# EAGLE schematic Prairie_Dogs_V1.3 (EAGLE 9.6.2)
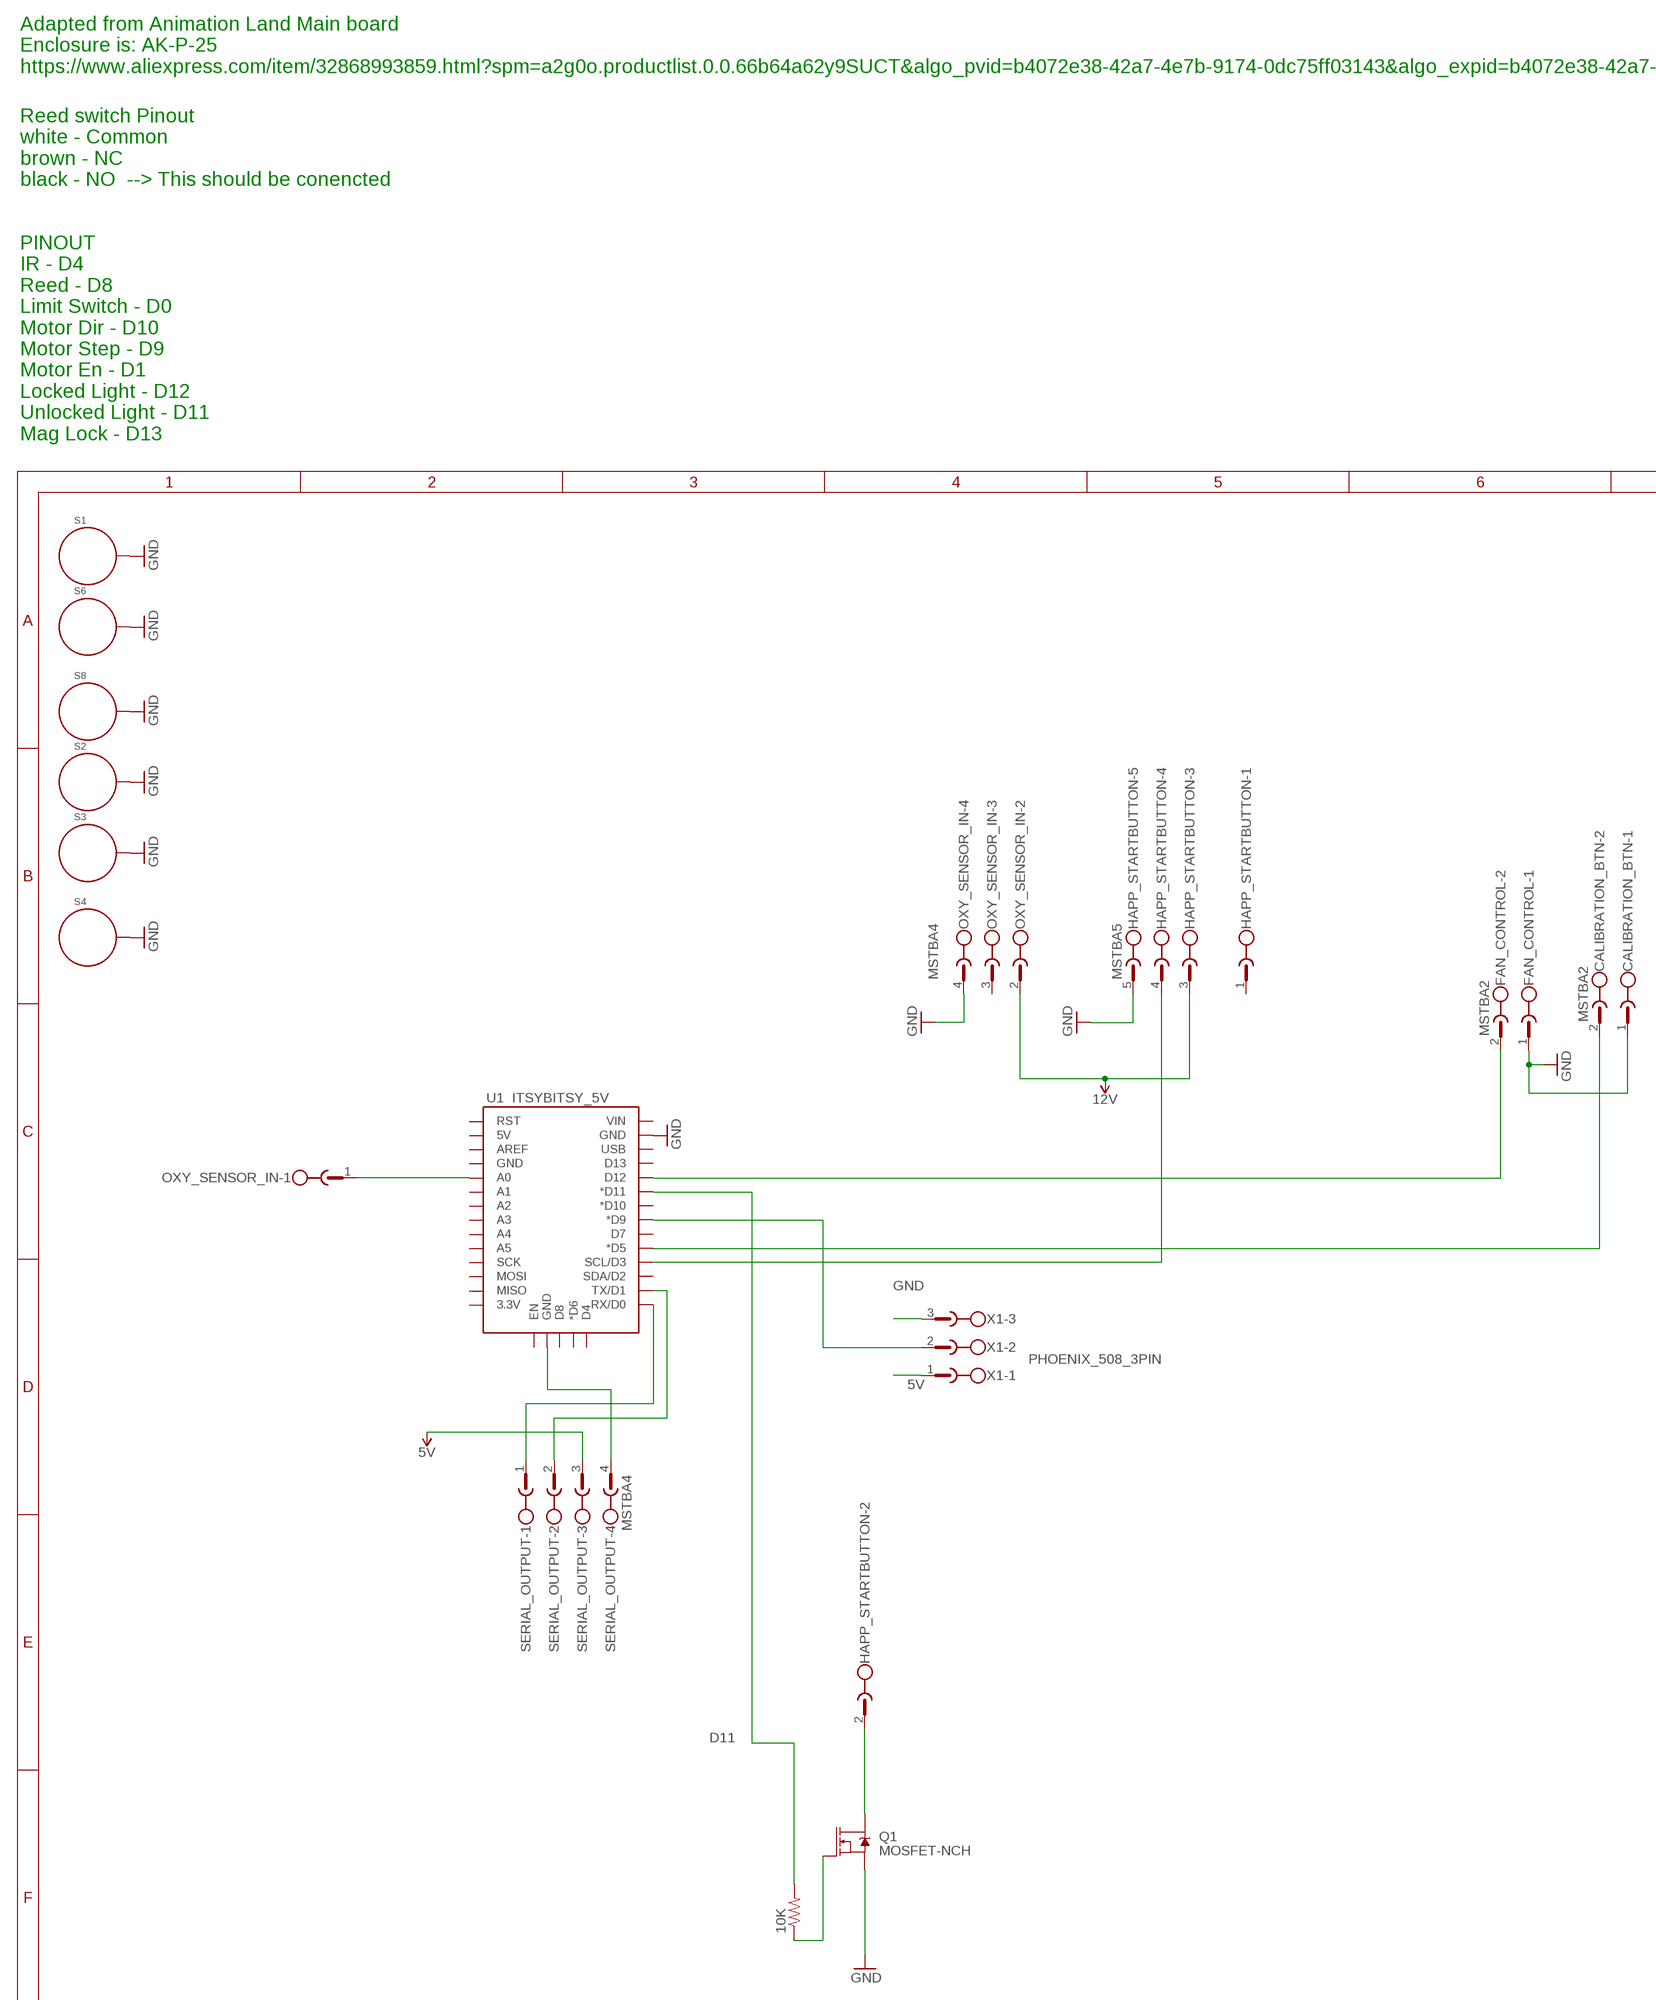
[diagram p0: schematic, sheet 1, part 1 of 2]
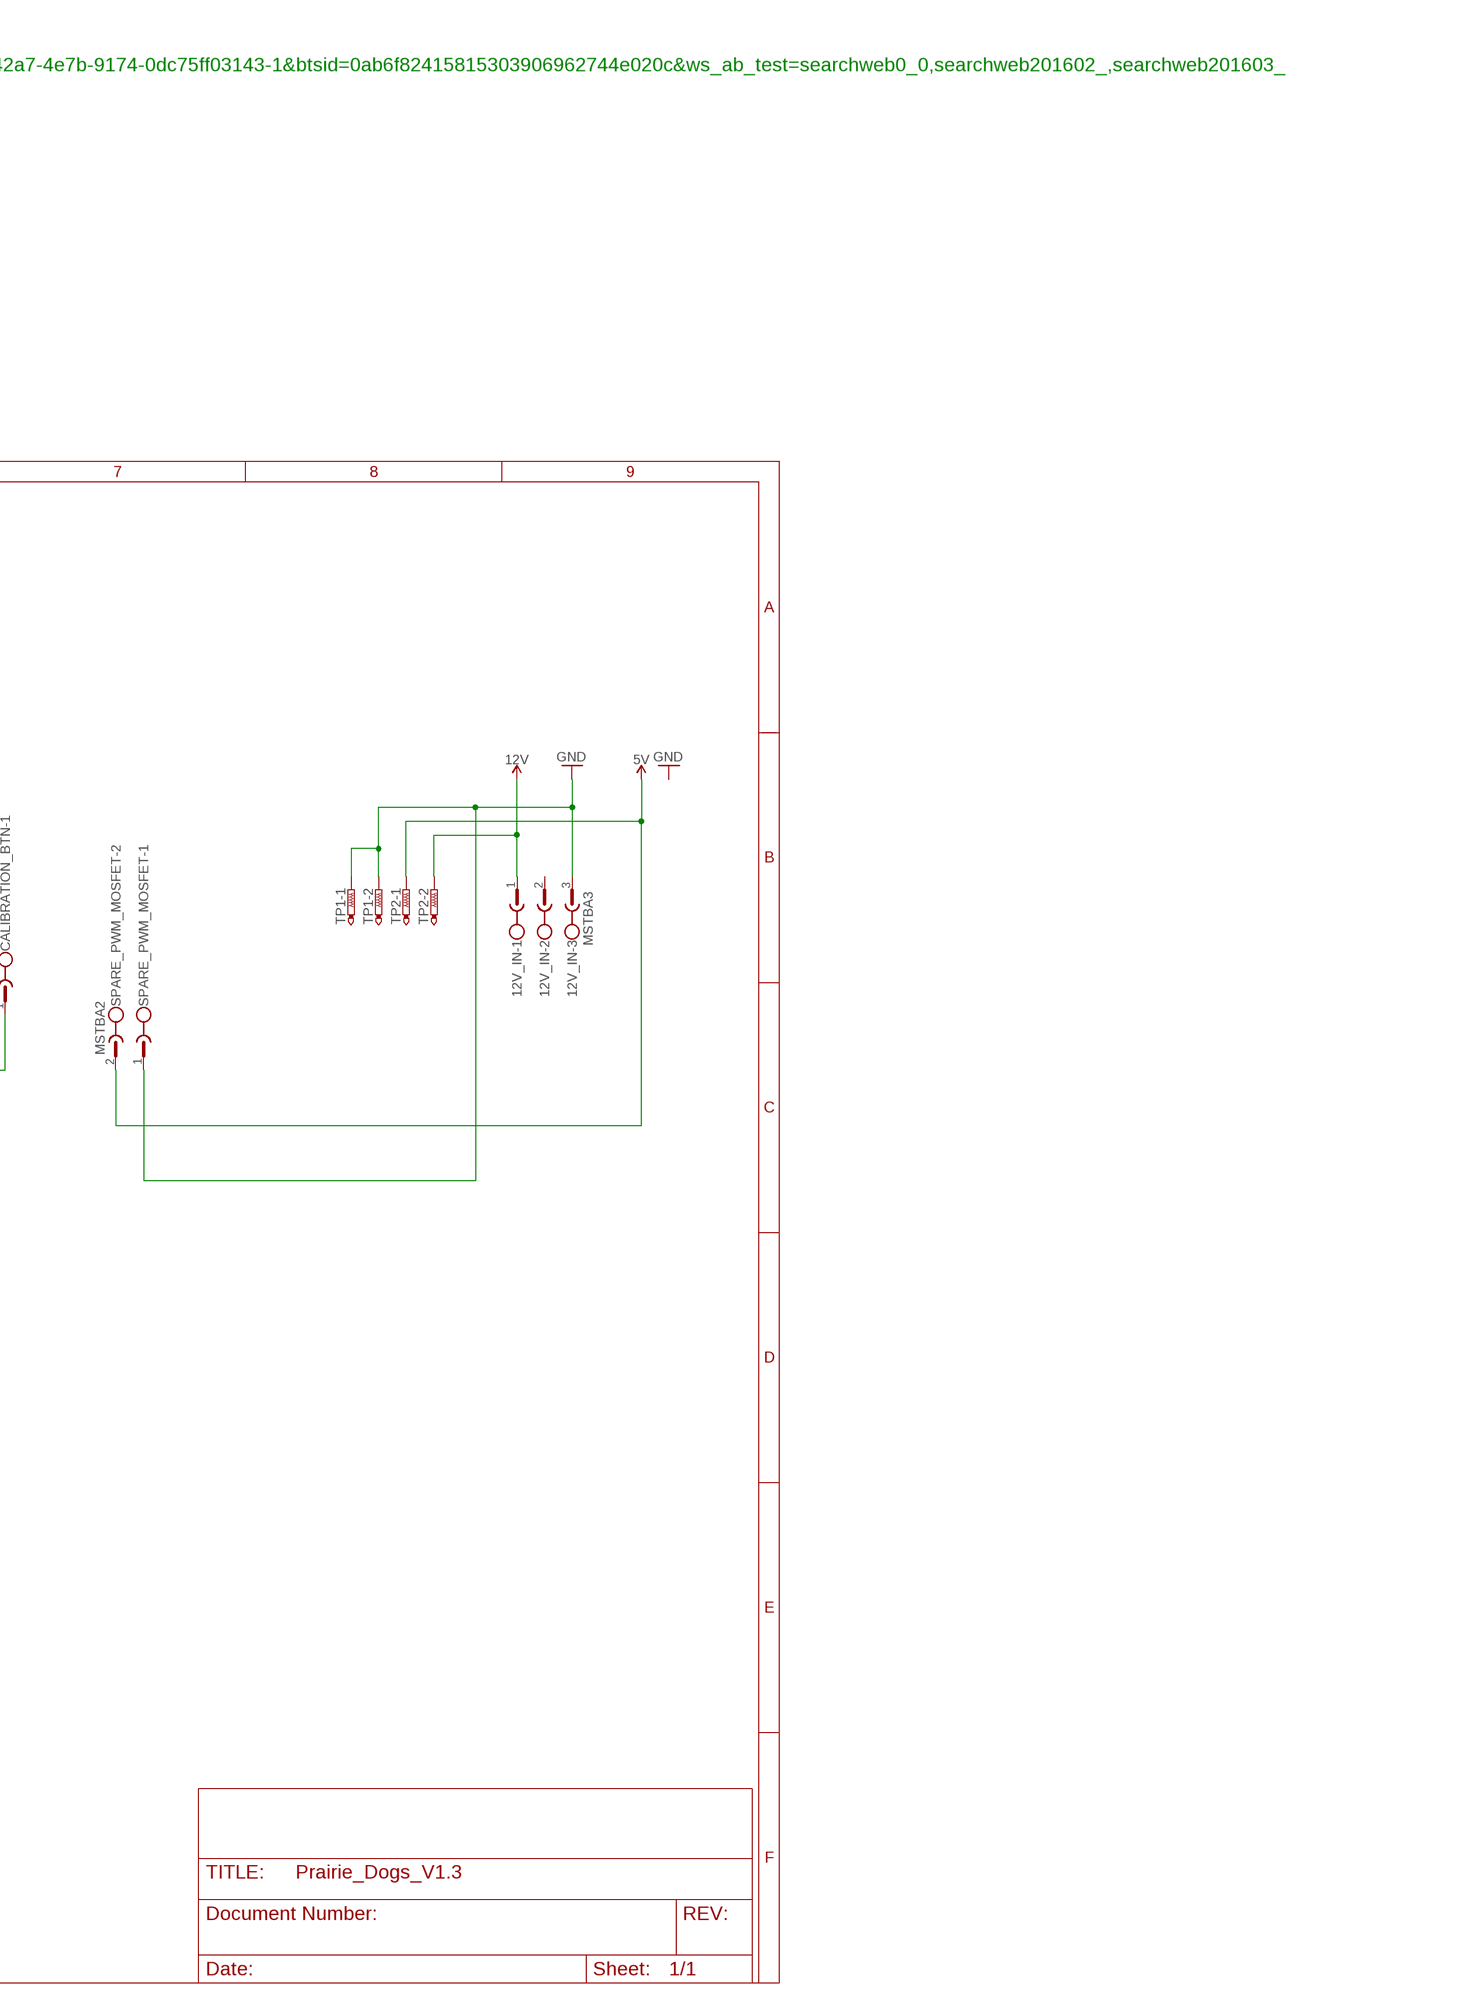
[diagram p1: schematic, sheet 1, part 2 of 2]

## Parts
10K  R-US_M0805  [M0805]
12V_IN  MSTBA3  [MSTBA3]
CALIBRATION_BTN  MSTBA2  [MSTBA2]
FAN_CONTROL  MSTBA2  [MSTBA2]
HAPP_STARTBUTTON  MSTBA5  [MSTBA5]
OXY_SENSOR_IN  MSTBA4  [MSTBA4]
Q1  MOSFET-NCH  [SO-8_POWER_PAK]
S1  STANDOFF_ELECTRICAL5-32  [STANDOFF_ELECTRICAL_5_32]
S2  STANDOFF_ELECTRICAL5-32  [STANDOFF_ELECTRICAL_5_32]
S3  STANDOFF_ELECTRICAL5-32  [STANDOFF_ELECTRICAL_5_32]
S4  STANDOFF_ELECTRICAL5-32  [STANDOFF_ELECTRICAL_5_32]
S6  STANDOFF_ELECTRICAL5-32  [STANDOFF_ELECTRICAL_5_32]
S8  STANDOFF_ELECTRICAL5-32  [STANDOFF_ELECTRICAL_5_32]
SERIAL_OUTPUT  MSTBA4  [MSTBA4]
SPARE_PWM_MOSFET  MSTBA2  [MSTBA2]
TP1  PTR2  [P2-38-17]
TP2  PTR2  [P2-38-17]
U1  ITSYBITSY_5V  [ADAFRUIT_LENOARDO]
X1  PHOENIX_508_3PIN  [PHOENIX_508_3PIN]

## Nets
5V [High Power]: SERIAL_OUTPUT.3 SPARE_PWM_MOSFET.2 TP2.TP-1 X1.1
12V [High Power]: 12V_IN.1 HAPP_STARTBUTTON.3 OXY_SENSOR_IN.2 TP2.TP-2
D11: 10K.2 U1.D11(*D11)
GND [High Power]: 12V_IN.3 CALIBRATION_BTN.1 FAN_CONTROL.1 HAPP_STARTBUTTON.5 OXY_SENSOR_IN.4 Q1.S S1.P1 S2.P1 S3.P1 S4.P1 S6.P1 S8.P1 SPARE_PWM_MOSFET.1 TP1.TP-1 TP1.TP-2 U1.GND@2(GND) X1.3
N$1: HAPP_STARTBUTTON.2 Q1.D1(D)
N$2: HAPP_STARTBUTTON.4 U1.SCL(SCL/D3)
N$3: OXY_SENSOR_IN.1 U1.A0
N$5: U1.D9(*D9) X1.2
N$6: 10K.1 Q1.G
N$8: SERIAL_OUTPUT.2 U1.TX(TX/D1)
N$10: SERIAL_OUTPUT.4 U1.GND@1(GND)
N$11: SERIAL_OUTPUT.1 U1.RX(RX/D0)
N$12: FAN_CONTROL.2 U1.D12
N$14: CALIBRATION_BTN.2 U1.D5(*D5)
Unconnected: 12V_IN.2 HAPP_STARTBUTTON.1 OXY_SENSOR_IN.3 U1.3V(3.3V) U1.5V U1.A1 U1.A2 U1.A3 U1.A4 U1.A5 U1.AREF U1.D4 U1.D6(*D6) U1.D7 U1.D8 U1.D10(*D10) U1.D13 U1.EN U1.GND@0(GND) U1.MISO U1.MOSI U1.RES(RST) U1.SCK U1.SDA(SDA/D2) U1.USB U1.VIN

## Notes on the sheet
- Adapted from Animation Land Main board
  Enclosure is: AK-P-25
  https://www.aliexpress.com/item/32868993859.html?spm=a2g0o.productlist.0.0.66b64a62y9SUCT&algo_pvid=b4072e38-42a7-4e7b-9174-0dc75ff03143&algo_expid=b4072e38-42a7-4e7b-9174-0dc75ff03143-1&btsid=0ab6f82415815303906962744e020c&ws_ab_test=searchweb0_0,searchweb201602_,searchweb201603_
- Reed switch Pinout
  white - Common
  brown - NC
  black - NO  --> This should be conencted
  
  
  PINOUT
  IR - D4
  Reed - D8
  Limit Switch - D0
  Motor Dir - D10
  Motor Step - D9
  Motor En - D1
  Locked Light - D12
  Unlocked Light - D11
  Mag Lock - D13

## Library data of the parts
10K = adafruit:R-US_: RESISTOR, American symbol
12V_IN = con-phoenix-508:MSTBA3: PHOENIX; MF: FARNELL; MPN: 1757255; OC_FARNELL: 3705183; OC_NEWARK: 71C4162
CALIBRATION_BTN FAN_CONTROL SPARE_PWM_MOSFET = th_libraries:MSTBA2: PHOENIX; MF: FARNELL; MPN: 1757242; OC_FARNELL: 3705171; OC_NEWARK: 71C4161
HAPP_STARTBUTTON = con-phoenix-508:MSTBA5: PHOENIX; MPN: 1757271; OC_FARNELL: 3705201; OC_NEWARK: 71C4164
OXY_SENSOR_IN SERIAL_OUTPUT = th_libraries:MSTBA4: PHOENIX; MF: FARNELL; MPN: 1757268; OC_FARNELL: 3705195; OC_NEWARK: 71C4163
Q1 = th_ds_libraries:MOSFET-NCH: N-channel MOSFETs from Sparkfun-DiscreteSemi Library
S1-S4 S6 S8 = th_libraries:STANDOFF_ELECTRICAL: A standoff intended to be an electrically connected point. Pad size and stop size allow for a #8 Phillips pan screw head to make a solid connection to the board. Added 144mill drill hole that fits my normal wood screw
TP1 TP2 = testpad:PTR2: TEST PIN
U1 = th_ds_libraries:ITSYBITSY_5V: Adafruit ItsyBitsy 32u4 - 5V 16MHz https://www.adafruit.com/product/3677
X1 = OMSI_Default_V1:PHOENIX_508_3PIN: PHOENIX; MF: FARNELL; MPN: 1757255; OC_FARNELL: 3705183; OC_NEWARK: 71C4162

## Net classes
1 High Power: width 0.406 mm, drill 0.483 mm
2 Low Power: width 0.305 mm, drill 0.483 mm